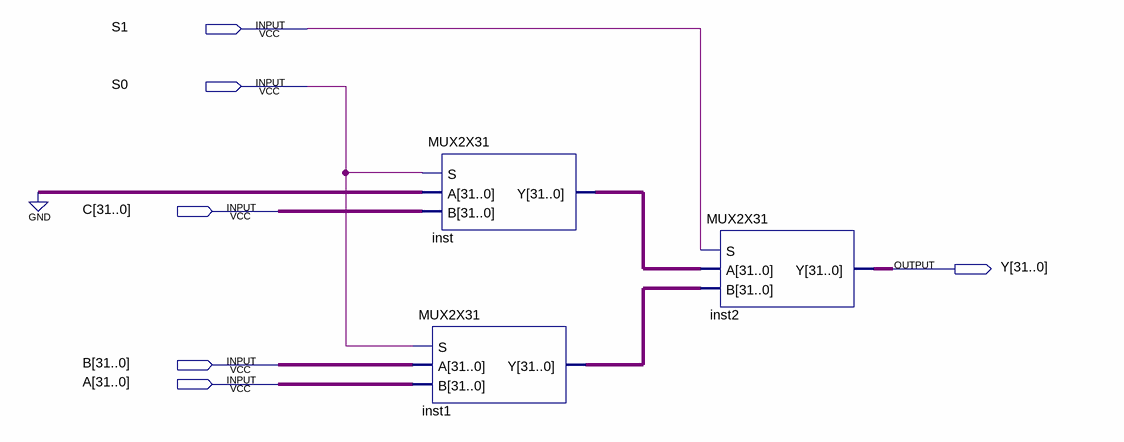
[diagram p0: schematic sheet]
// Quartus schematic MUX3x1.bdf as structural Verilog: 3 symbols, 6 pins
module MUX3x1 (
  input  S1,
  input  S0,
  input  [31:0] C,
  input  [31:0] B,
  input  [31:0] A,
  output [31:0] Y
);

  wire [31:0] inst1_y, inst_y;

  MUX2X31 inst1 (.S(S0), .A(B), .B(A), .Y(inst1_y));
  MUX2X31 inst (.S(S0), .A({32{1'b0}}), .B(C), .Y(inst_y));
  MUX2X31 inst2 (.S(S1), .A(inst_y), .B(inst1_y), .Y(Y));
endmodule
